# Altium schematic sheet sensor.SchDoc
size A; SheetNumber: 1; SheetTotal: 1
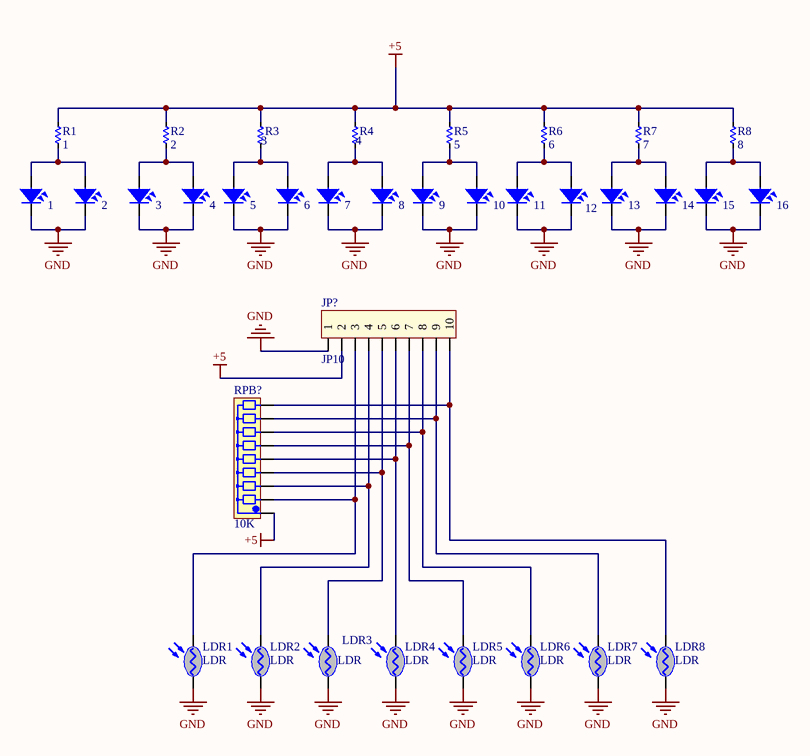
[diagram p0: sensor.SchDoc]

## Parts
1  LED  [LED-5-WHITE]  (value not drawn)
2  LED  [LED-5-WHITE]  (value not drawn)
3  LED  [LED-5-WHITE]  (value not drawn)
4  LED  [LED-5-WHITE]  (value not drawn)
5  LED  [LED-5-WHITE]  (value not drawn)
6  LED  [LED-5-WHITE]  (value not drawn)
7  LED  [LED-5-WHITE]  (value not drawn)
8  LED  [LED-5-WHITE]  (value not drawn)
9  LED  [LED-5-WHITE]  (value not drawn)
10  LED  [LED-5-WHITE]  (value not drawn)
11  LED  [LED-5-WHITE]  (value not drawn)
12  LED  [LED-5-WHITE]  (value not drawn)
13  LED  [LED-5-WHITE]  (value not drawn)
14  LED  [LED-5-WHITE]  (value not drawn)
15  LED  [LED-5-WHITE]  (value not drawn)
16  LED  [LED-5-WHITE]  (value not drawn)
JP?  JP10  [Header10]
LDR1  LDR  [CDS]
LDR2  LDR  [CDS]
LDR3  LDR  [CDS]
LDR4  LDR  [CDS]
LDR5  LDR  [CDS]
LDR6  LDR  [CDS]
LDR7  LDR  [CDS]
LDR8  LDR  [CDS]
R1  1  [RES-1/2W]
R2  2  [RES-1/2W]
R3  3  [RES-1/2W]
R4  4  [RES-1/2W]
R5  5  [RES-1/2W]
R6  6  [RES-1/2W]
R7  7  [RES-1/2W]
R8  8  [RES-1/2W]
RPB?  10K  [RN8]

## Nets
+5: JP?.2 R1.1 R2.1 R3.1 R4.1 R5.1 R6.1 R7.1 R8.1 RPB?.1
GND: 1.2 2.2 3.2 4.2 5.2 6.2 7.2 8.2 9.2 10.2 11.2 12.2 13.2 14.2 15.2 16.2 JP?.1 LDR1.1(A) LDR2.1(A) LDR3.1(A) LDR4.1(A) LDR5.1(A) LDR6.1(A) LDR7.1(A) LDR8.1(A)
Net1_1: 1.1 2.1 R1.2
Net3_1: 3.1 4.1 R2.2
Net5_1: 5.1 6.1 R3.2
Net7_1: 7.1 8.1 R4.2
Net9_1: 9.1 10.1 R5.2
Net11_1: 11.1 12.1 R6.2
Net13_1: 13.1 14.1 R7.2
Net15_1: 15.1 16.1 R8.2
NetJP?_3: JP?.3 LDR1.2(K) RPB?.2
NetJP?_4: JP?.4 LDR2.2(K) RPB?.3
NetJP?_5: JP?.5 LDR3.2(K) RPB?.4
NetJP?_6: JP?.6 LDR4.2(K) RPB?.5
NetJP?_7: JP?.7 LDR5.2(K) RPB?.6
NetJP?_8: JP?.8 LDR6.2(K) RPB?.7
NetJP?_9: JP?.9 LDR7.2(K) RPB?.8
NetJP?_10: JP?.10 LDR8.2(K) RPB?.9

## Library data of the parts
1-16 = LED: LED Single colour Green and Red; Value: LED 3 ly Single Colour
JP? = Header10: Connector 10; Value: Connector 10
LDR1-LDR8 = LDR: Quang Tro
R1-R8 = Res: Manufacturer: Generic Components; Class: Passive; SubClass: R; Published: 08/06/2000; Publisher: Altium Hobart Technology Centre
RPB? = RN8: Resistor 8 (Thanh); Value: Tro thanh 10K